# Altium schematic sheet 12VSupply.SchDoc
size A
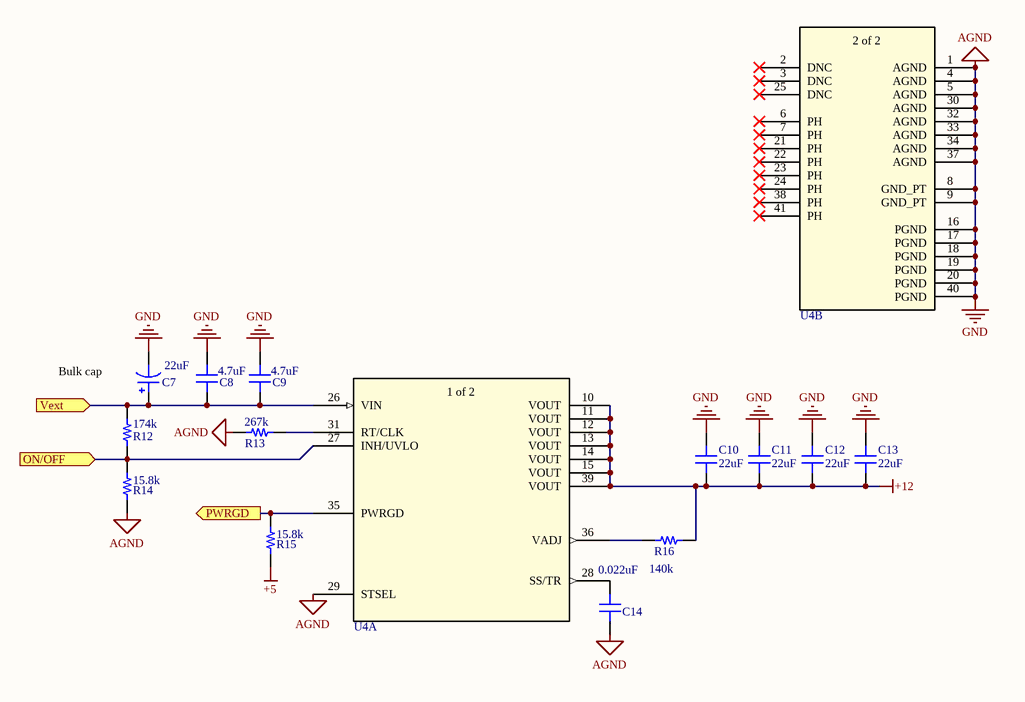
[diagram p0: 12VSupply.SchDoc]

## Parts
C7  22uF  [CAP AL TH D8 L3.5 H11.5]
C8  4.7uF  [CAP 1206/3216 - 1.0MM]
C9  4.7uF  [CAP 1206/3216 - 1.0MM]
C10  22uF  [CAP 1206/3216]
C11  22uF  [CAP 1206/3216]
C12  22uF  [CAP 1206/3216]
C13  22uF  [CAP 1206/3216]
C14  0.022uF  [CAP 0805/2012]
R12  174k  [RES 0805/2012]
R13  267k  [RES 1206/3216]
R14  15.8k  [RES 0805/2012]
R15  15.8k  [RES 0805/2012]
R16  140k  [RES 0805/2012]
U4  LMZ35003RKGR  [RKG41]  (value not drawn)  (parts A,B of 2)

## Ports
ON/OFF (in), PWRGD (out), Vext (in)

## Nets
+5: R15.1
+12: C10.2 C11.2 C12.2 C13.2 R16.2 U4.10(VOUT) U4.11(VOUT) U4.12(VOUT) U4.13(VOUT) U4.14(VOUT) U4.15(VOUT) U4.39(VOUT)
AGND: C7.2 C8.2 C9.2 C10.1 C11.1 C12.1 C13.1 C14.1 R13.1 R14.1 U4.1(AGND) U4.4(AGND) U4.5(AGND) U4.8(GND_PT) U4.9(GND_PT) U4.16(PGND) U4.17(PGND) U4.18(PGND) U4.19(PGND) U4.20(PGND) U4.29(STSEL) U4.30(AGND) U4.32(AGND) U4.33(AGND) U4.34(AGND) U4.37(AGND) U4.40(PGND)  [also labelled GND]
ON/OFF: R12.1 R14.2 U4.27(INH/UVLO) ; port ON/OFF
PWRGD: R15.2 U4.35(PWRGD) ; port PWRGD
Vext: C7.1 C8.1 C9.1 R12.2 U4.26(VIN) ; port Vext
NetC14_2: C14.2 U4.28(SS/TR)
NetR13_2: R13.2 U4.31(RT/CLK)
NetR16_1: R16.1 U4.36(VADJ)

Not connected (* = marked no-connect by the designer): U4 2(DNC)* 3(DNC)* 6(PH)* 7(PH)* 21(PH)* 22(PH)* 23(PH)* 24(PH)* 25(DNC)* 38(PH)* 41(PH)*

## Notes on the sheet
- Bulk cap
- (in symbol LMZ34003, part A) 1 of 2
- (in symbol LMZ34003, part B) 2 of 2

## Library data of the parts
C7 = EEU-FC2A220: CAP ALUM 22UF 20% 100V RADIAL; Manufacturer: Panasonic Electronic Components; TemperatureRange: -55°C ~ 105°C; Type: Automotive; Ripple Current: 169mA; Lifetime @ Temp: 2000 Hrs @ 105°C; Value: 22uF; Part Number: EEU-FC2A220; PartId: 7484; Supplier 1: Digi-Key; Supplier Part Number 1: P10770-ND; ComponentLink1Description: Datasheet; ComponentLink1URL: https://industrial.panasonic.com/ww/products/capacitors/aluminum-capacitors/aluminum-cap-lead/fc/EEUFC2A220; ComponentLink2Description: Digi-Key listing; ComponentLink2URL: https://www.digikey.com/product-detail/en/panasonic-electronic-components/EEU-FC2A220/P10770-ND/285722; Tolerance: 20%; Voltage: 100V; Price: 0.46; Device Package: Radial, Can - TH
C8 C9 = C3216X5R1H475K085AB: CAP CER 4.7UF 50V X5R 1206; Manufacturer: TDK Corporation; TemperatureRange: -55C ~ 85C; Tolerance: 10%; Value: 4.7uF; Part Number: C3216X5R1H475K085AB; PartId: 17022; Supplier 1: Digi-Key; Supplier Part Number 1: 445-14692-2-ND; ComponentLink1Description: Datasheet; ComponentLink1URL: https://product.tdk.com/info/en/catalog/datasheets/mlcc_commercial_general_en.pdf; ComponentLink2Description: Digi-Key Listing; ComponentLink2URL: https://www.digikey.com/product-detail/en/tdk-corporation/C3216X5R1H475K085AB/445-14692-2-ND/3951928; TemperatureCoefficient: X5R; Voltage: 50V; Price: 0.3159; Device Package: 1206 (3216 Metric)
C10-C13 = CL31A226KAHNNNE: CAP CER 22UF 25V X5R 1206; Manufacturer: Samsung Electro-Mechanics America, Inc.; TemperatureRange: -55C ~ 85C; Tolerance: 10%; Value: 22uF; Part Number: CL31A226KAHNNNE; PartId: 15794; Supplier 1: Digi-Key; Supplier Part Number 1: 1276-3047-2-ND; ComponentLink1Description: Datasheet; ComponentLink1URL: //media.digikey.com/pdf/Data%20Sheets/Samsung%20PDFs/CL31A226KAHNNNE_Spec.pdf; ComponentLink2Description: Digi-Key Listing; ComponentLink2URL: https://www.digikey.com/product-detail/en/samsung-electro-mechanics-america-inc/CL31A226KAHNNNE/1276-3047-2-ND/3888705; TemperatureCoefficient: X5R; Voltage: 25V; Price: 0.1785; Device Package: 1206 (3216 Metric)
C14 = C0805S223K1RAC7800: CAP CER 0.022UF 100V X7R 0805; Manufacturer: Kemet; TemperatureRange: -55C ~ 125C; Tolerance: 10%; Value: 0.022uF; Part Number: C0805S223K1RAC7800; PartId: 14304; Supplier 1: Digi-Key; Supplier Part Number 1: 399-13176-2-ND; ComponentLink1Description: Datasheet; ComponentLink1URL: http://www.kemet.com/docfinder?Partnumber=C0805S223K1RACTU; ComponentLink2Description: Digi-Key Listing; ComponentLink2URL: https://www.digikey.com/product-detail/en/kemet/C0805S223K1RAC7800/399-13176-2-ND/2213362; TemperatureCoefficient: X7R; Voltage: 100V; Price: 0.071; Device Package: 0805 (2012 Metric)
R12 = ERJ-6ENF1743V: RES SMD 174K OHM 1% 1/8W 0805; Manufacturer: Panasonic Electronic Components; TemperatureRange: -55C ~ 155C; TemperatureCoefficient: 100ppm/C; PowerRating: 0.125W, 1/8W; Value: 174k; Part Number: ERJ-6ENF1743V; PartId: 2344; Supplier 1: Digi-Key; Supplier Part Number 1: P174KCTR-ND; ComponentLink1Description: Datasheet; ComponentLink1URL: http://industrial.panasonic.com/www-cgi/jvcr13pz.cgi?E+PZ+3+AOA0002+ERJ6ENF1743V+7+WW; ComponentLink2Description: Digi-Key listing; ComponentLink2URL: http://digikey.com/product-detail/en/ERJ-6ENF1743V/P174KCTR-ND/111921; Tolerance: 1%; Price: 0.0073; Type: Thick Film; Device Package: 0805 (2012 Metric)
R13 = ERJ-8ENF2673V: RES SMD 267K OHM 1% 1/4W 1206; Manufacturer: Panasonic Electronic Components; TemperatureRange: -55C ~ 155C; TemperatureCoefficient: 100ppm/C; PowerRating: 0.25W, 1/4W; Value: 267k; Part Number: ERJ-8ENF2673V; PartId: 3280; Supplier 1: Digi-Key; Supplier Part Number 1: P267KFTR-ND; ComponentLink1Description: Datasheet; ComponentLink1URL: http://industrial.panasonic.com/www-cgi/jvcr13pz.cgi?E+PZ+3+AOA0002+ERJ8ENF2673V+7+WW; ComponentLink2Description: Digi-Key listing; ComponentLink2URL: http://digikey.com/product-detail/en/ERJ-8ENF2673V/P267KFTR-ND/89429; Tolerance: 1%; Price: 0.0093; Type: Thick Film; Device Package: 1206 (3216 Metric)
R14 R15 = ERJ-6ENF1582V: RES SMD 15.8K OHM 1% 1/8W 0805; Manufacturer: Panasonic Electronic Components; TemperatureRange: -55C ~ 155C; TemperatureCoefficient: 100ppm/C; PowerRating: 0.125W, 1/8W; Value: 15.8k; Part Number: ERJ-6ENF1582V; PartId: 2101; Supplier 1: Digi-Key; Supplier Part Number 1: P15.8KCTR-ND; ComponentLink1Description: Datasheet; ComponentLink1URL: http://industrial.panasonic.com/www-cgi/jvcr13pz.cgi?E+PZ+3+AOA0002+ERJ6ENF1582V+7+WW; ComponentLink2Description: Digi-Key listing; ComponentLink2URL: http://digikey.com/product-detail/en/ERJ-6ENF1582V/P15.8KCTR-ND/6419; Tolerance: 1%; Price: 0.0073; Type: Thick Film; Device Package: 0805 (2012 Metric)
R16 = ERJ-6ENF1403V: RES SMD 140K OHM 1% 1/8W 0805; Manufacturer: Panasonic Electronic Components; TemperatureRange: -55C ~ 155C; TemperatureCoefficient: 100ppm/C; PowerRating: 0.125W, 1/8W; Value: 140k; Part Number: ERJ-6ENF1403V; PartId: 2209; Supplier 1: Digi-Key; Supplier Part Number 1: P140KCTR-ND; ComponentLink1Description: Datasheet; ComponentLink1URL: http://industrial.panasonic.com/www-cgi/jvcr13pz.cgi?E+PZ+3+AOA0002+ERJ6ENF1403V+7+WW; ComponentLink2Description: Digi-Key listing; ComponentLink2URL: http://digikey.com/product-detail/en/ERJ-6ENF1403V/P140KCTR-ND/111888; Tolerance: 1%; Price: 0.0073; Type: Thick Film; Device Package: 0805 (2012 Metric)
U4 = LMZ34003: DC DC CONVERTER 2.5-15V 38W; Manufacturer_Part_Number: LMZ34002RKGT; Vendor: Texas Instruments; Built_By: EMA_UL_Team; Output Configuration: Positive; Topology: Buck, Buck-Boost; Output Type: Adjustable; Number Of Outputs: 1; Voltage - Input (Min): 7V; Voltage - Input (Max): 50V; Voltage - Output (Min/Fixed): 2.5V; Voltage - Output (Max): 15V; Current Output: 2.5A; Frequency - Switching: 800kHz; Synchronous Rectifier: No; Copyright: Copyright (C) 2018 Accelerated Designs. All rights reserved; RefDes: RefDes; Type: Non-Isolated PoL Module; Value: Value; Part Number: LMZ34003; PartId: 16768; Manufacturer: Texas Instruments; Supplier 1: Digi-Key; Supplier Part Number 1: 296-43647-1-ND; ComponentLink1Description: Datasheet; ComponentLink1URL: http://www.ti.com/lit/ds/symlink/lmz35003.pdf; ComponentLink2Description: Digi-Key Listing; ComponentLink2URL: https://www.digikey.com/product-detail/en/texas-instruments/LMZ35003RKGR/296-43647-1-ND/5864851; Device Package: 41-B1QFN (11x9); Price: 11.89; Series: SIMPLE SWITCHER®; Operating Temperature: -40°C ~ 85°C